# EAGLE design adc (EAGLE 7.2.0)
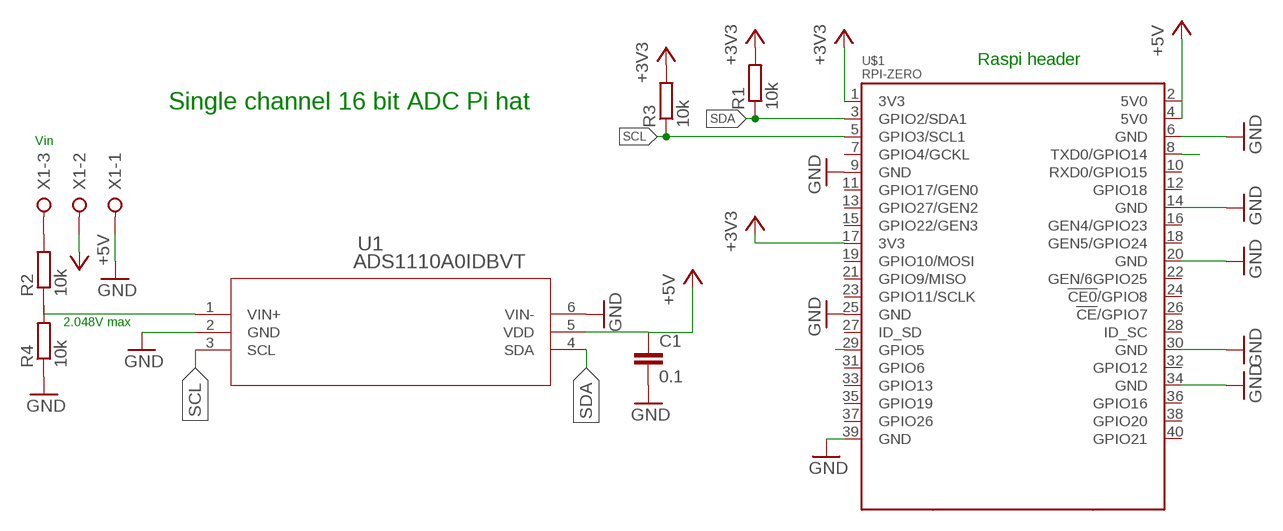
[diagram p0: schematic, sheet 1]

## Parts
C1  0.1  C-EUC0603  [C0603]
R1  10k  R-EU_R0603  [R0603]
R2  10k  R-EU_R0603  [R0603]
R3  10k  R-EU_R0603  [R0603]
R4  10k  R-EU_R0603  [R0603]
U1  ADS1110A0IDBVT  [DBV6]
U$1  RPI-ZERO  [RASPBERRYPI_BASTELSTUBE_V13_RASPI_BOARD_B+_FULL]
X1  W237-3E  [W237-3E]

## Nets
3V3@2: U$1.17(3V3) ; supply symbol labelled +3V3
+3V3: R1.2 R3.2 U$1.1(3V3)
+5V: C1.1 U1.5(VDD) U$1.2(5V0) U$1.4(5V0) X1.2
GND: C1.2 R4.1 U1.2(GND) U1.6(VIN-) U$1.6(GND) U$1.9(GND) U$1.14(GND) U$1.20(GND) U$1.25(GND) U$1.30(GND) U$1.34(GND) U$1.39(GND) X1.1
N$1: R2.1 R4.2 U1.1(VIN+)
N$2: R2.2 X1.3
PGATE: U$1.29(GPIO5)
SCL: R3.1 U1.3(SCL) U$1.5(GPIO3/SCL1)
SDA: R1.1 U1.4(SDA) U$1.3(GPIO2/SDA1)
TX: U$1.8(TXD0/GPIO14)
Unconnected: U$1.7(GPIO4/GCKL) U$1.10(RXD0/GPIO15) U$1.11(GPIO17/GEN0) U$1.12(GPIO18) U$1.13(GPIO27/GEN2) U$1.15(GPIO22/GEN3) U$1.16(GEN4/GPIO23) U$1.18(GEN5/GPIO24) U$1.19(GPIO10/MOSI) U$1.21(GPIO9/MISO) U$1.22(GEN/6GPIO25) U$1.23(GPIO11/SCLK) U$1.24(!CE0!/GPIO8) U$1.26(!CE!/GPIO7) U$1.27(ID_SD) U$1.28(ID_SC) U$1.31(GPIO6) U$1.32(GPIO12) U$1.33(GPIO13) U$1.35(GPIO19) U$1.36(GPIO16) U$1.37(GPIO26) U$1.38(GPIO20) U$1.40(GPIO21)

## Notes on the sheet
- Raspi header
- Single channel 16 bit ADC Pi hat
- Vin
- 2.048V max

## Library data of the parts
C1 = rcl:C-EU: CAPACITOR, European symbol
R1-R4 = rcl:R-EU_: RESISTOR, European symbol
U1 = ads1110:ADS1110A0IDBVT; MANUFACTURER_PART_NUMBER: ADS1110A0IDBVT; VENDOR: Texas Instruments
U$1 = RPI-Zero:RPI-ZERO
X1 = con-wago-508:W237-3E: WAGO SREW CLAMP; OC_FARNELL: unknown; OC_NEWARK: unknown

## Net classes
0 default: width 0.152 mm, drill 0.305 mm, clearance 0.152 mm

## Board
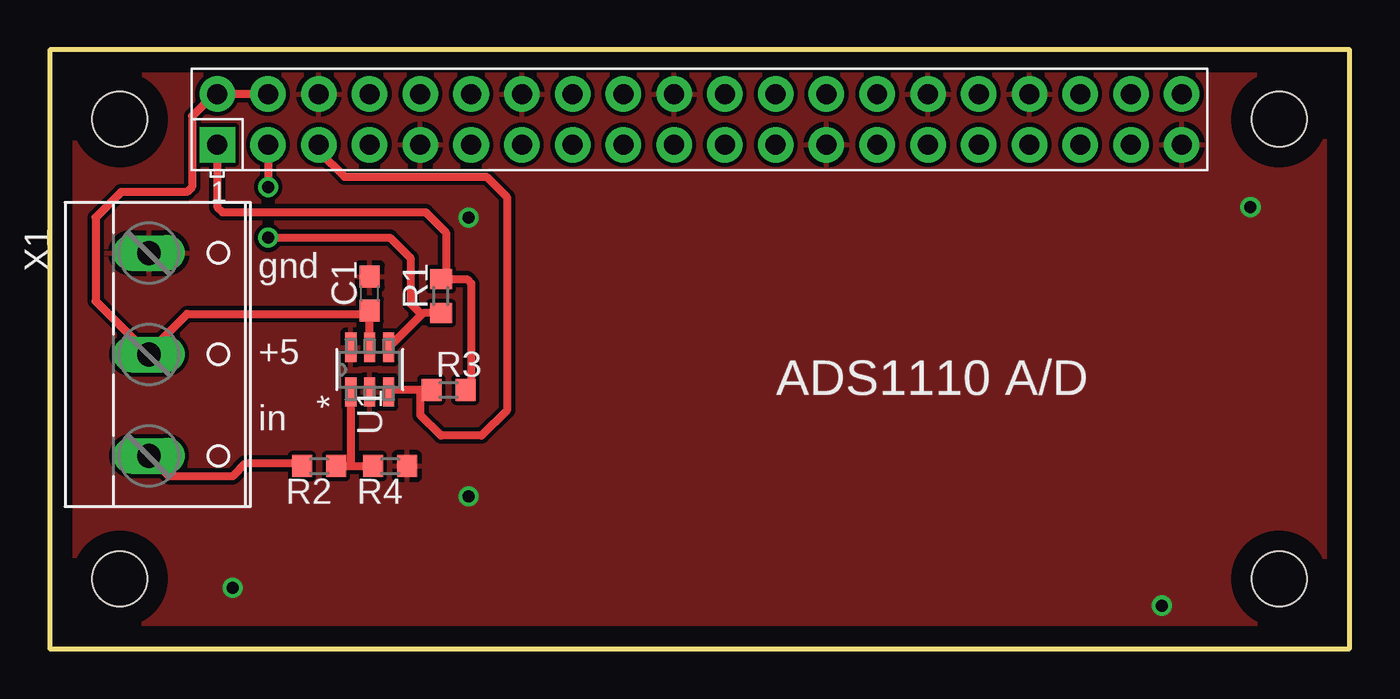
[diagram p1: board, top side]
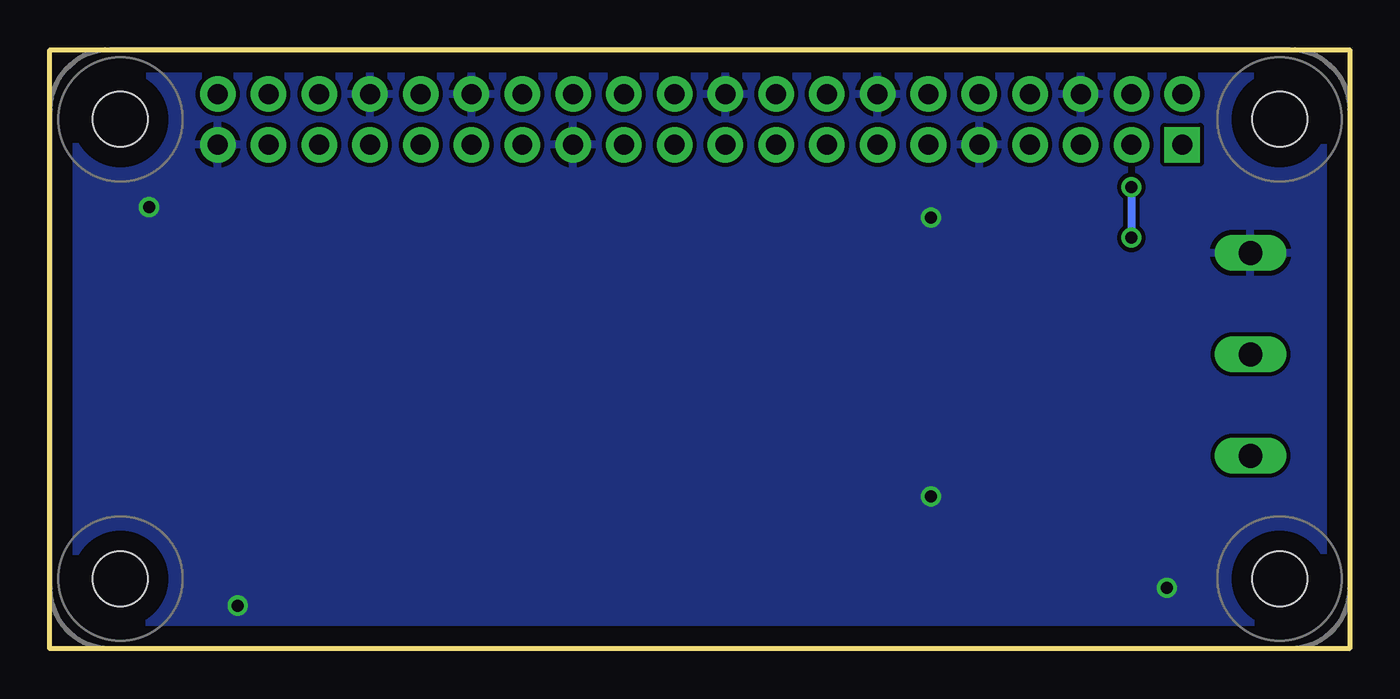
[diagram p2: board, bottom side, seen from below]

Size 65.02 x 29.97 mm. Coordinates in mm from the lower left corner, seen from the top.
Outline: 0,0 65.02,0 65.02,29.97 0,29.97 0,0
Copper layers (1*16): Top 0.035mm / dielectric 1.5mm / Bottom 0.035mm
Design rules "default": minimum track width 10mil, minimum drill 24mil, track to track 8mil, track to pad 8mil, pad to pad 8mil, via to via 8mil, smd to smd 8mil, copper to edge 40mil, drill to drill 8mil, minimum pad ring 10mil, minimum via ring 8mil, stop-mask expansion 4mil, vias tented up to drill 0mil, thermal gap 10mil

### Footprints (pad centres in the part's own frame; a part is rotated, then mirrored left to right if it is on the bottom)
C0603 = smd 1.1 x 1: 1 -0.85,0; 2 0.85,0
R0603 = smd 1 x 1.1: 1 -0.85,0; 2 0.85,0
DBV6 = smd 1.473 x 0.559: 1 -1.118,0.95; 2 -1.118,0; 3 -1.118,-0.95; 4 1.118,-0.95; 5 1.118,0; 6 1.118,0.95
RASPBERRYPI_BASTELSTUBE_V13_RASPI_BOARD_B+_FULL = drill 1 pad 1.778 square: 1 8.37,25.23 | drill 1 pad 1.778: 2 8.37,27.77; 3 10.91,25.23; 4 10.91,27.77; 5 13.45,25.23; 6 13.45,27.77; 7 15.99,25.23; 8 15.99,27.77; 9 18.53,25.23; 10 18.53,27.77; 11 21.07,25.23; 12 21.07,27.77; 13 23.61,25.23; 14 23.61,27.77; 15 26.15,25.23; 16 26.15,27.77; 17 28.69,25.23; 18 28.69,27.77; 19 31.23,25.23; 20 31.23,27.77; 21 33.77,25.23; 22 33.77,27.77; 23 36.31,25.23; 24 36.31,27.77; 25 38.85,25.23; 26 38.85,27.77; 27 41.39,25.23; 28 41.39,27.77; 29 43.93,25.23; 30 43.93,27.77; 31 46.47,25.23; 32 46.47,27.77; 33 49.01,25.23; 34 49.01,27.77; 35 51.55,25.23; 36 51.55,27.77; 37 54.09,25.23; 38 54.09,27.77; 39 56.63,25.23; 40 56.63,27.77 | hole 2.75: 3.5,3.5; 3.5,26.5; 61.5,3.5; 61.5,26.5
W237-3E = drill 1.194 long: 1 -5.08,-0.635; 2 0,-0.635; 3 5.08,-0.635

### Placement (x,y rotation side)
C1  16,17.78 90 top
R1  19.56,17.65 90 top
R2  13.46,9.14 180 top
R3  19.94,12.95 0 top
R4  17.02,9.14 180 top
U1  16,13.97 90 top
U$1  0,0 0 top
X1  5.59,14.73 270 top

### Tracks (layer width: path | path; a pad name or v marks a point on that pad's centre or on a via)
+3V3
  Top 0.406: R3.2 21.08,13.25 21.08,18.29 20.87,18.5 R1.2 19.81,18.76 19.81,20.83 18.8,21.84 8.64,21.84 8.37,22.11 U$1.1
+5V
  Top 0.406: U1.5 C1.1 15.84,16.76 6.86,16.76 4.95,14.86 X1.2 2.29,17.4 2.29,21.59 3.56,22.86 6.86,22.86 7.11,23.11 7.11,26.67 8.21,27.77 U$1.2 U$1.4
GND  (via drill 0.6)
  other vias: 20.95,21.59 9.14,3.05 55.63,2.16 60.07,22.1 20.95,7.62
  pour Bottom: 0,0 65.02,0 65.02,29.97 0,29.97
  pour Top: 0,0 65.02,0 65.02,29.97 0,29.97
N$1
  Top 0.406: R2.1 14.99,9.14 | 14.99,9.14 R4.2 | U1.1 15.05,9.21 14.99,9.14
N$2
  Top 0.406: R2.2 12.61,9.27 9.78,9.27 9.14,8.64 5.97,8.64 X1.3
N$3  (via drill 0.6)
  other vias: 10.92,23.11
N$4  (via drill 0.6)
  other vias: 10.92,20.57
SCL
  Top 0.406: R3.1 18.54,12.95 | 18.54,12.95 17.05,12.95 U1.3 | U$1.5 13.45,24.9 14.73,23.62 21.84,23.62 22.86,22.61 22.86,11.94 21.59,10.67 19.56,10.67 18.54,11.68 18.54,12.95
SDA  (via drill 0.6)
  Top 0.406: R1.1 18.67,16.8 18.59,16.72 | 18.59,16.72 U1.4 | U$1.3 10.91,23.13 v10.92,23.11 | v10.92,20.57 17.02,20.57 18.03,19.56 18.03,17.27 18.59,16.72
  Bottom 0.406: v10.92,23.11 v10.92,20.57

### Text on the board
tNames: gnd | +5 | ADS1110 A/D | in